# Altium schematic sheet PowerSupply.SchDoc
size B
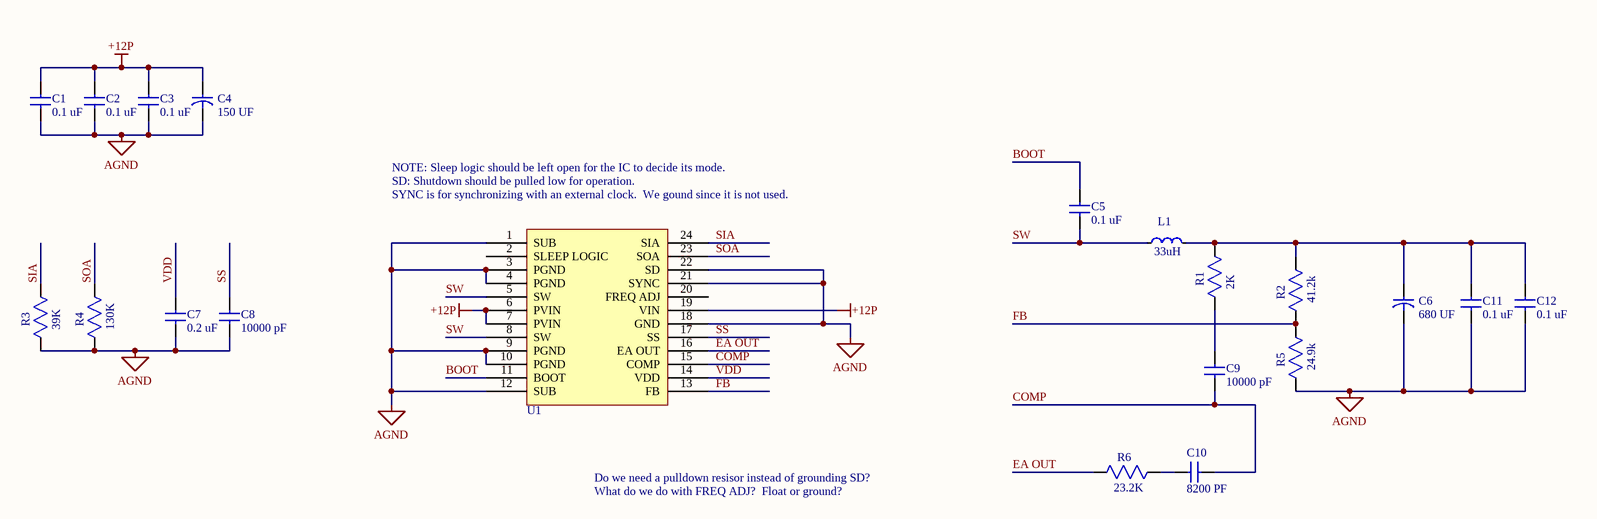
[diagram p0: PowerSupply.SchDoc]

## Parts
C1  value 0.1 uF  [0805]  (hidden comment: CAP 0.1uF)
C2  value 0.1 uF  [0805]  (hidden comment: CAP 0.1uF)
C3  value 0.1 uF  [0805]  (hidden comment: CAP 0.1uF)
C4  value 150 UF  [CAP_NICHICON_R7]  (hidden comment: CAP POLY 150UF)
C5  value 0.1 uF  [0805]  (hidden comment: CAP 0.1uF)
C6  value 680 UF  [CAP_NICHICON_R7]  (hidden comment: CAP POLY 680UF)
C7  value 0.2 uF  [0805]  (hidden comment: CAP 0.2uF)
C8  value 10000 pF  [0805]  (hidden comment: CAP 10000pF)
C9  value 10000 pF  [0805]  (hidden comment: CAP 10000pF)
C10  value 8200 PF  [0805]  (hidden comment: CAP 8200 PF)
C11  value 0.1 uF  [0805]  (hidden comment: CAP 0.1uF)
C12  value 0.1 uF  [0805]  (hidden comment: CAP 0.1uF)
L1  value 33uH  [L_SRR1210]  (hidden comment: L_33uH_20%)
R1  value 2K  [0805]  (hidden comment: R_0805_2K_1%)
R2  value 41.2k  [0805]  (hidden comment: R_0805_41.2K_1%)
R3  value 39K  [0805]  (hidden comment: R_0805_39K_1%)
R4  value 130K  [0805]  (hidden comment: R_0805_130K_1%)
R5  value 24.9k  [0805]  (hidden comment: R_0805_24.9k_1%)
R6  value 23.2K  [0805]  (hidden comment: R_0805_23.2K_1%)
U1  LM2650 DC/DC Converter  [SOIC127P1030X265-24N]  (value not drawn)

## Nets
+12P: C1.1 C2.1 C3.1 C4.1 U1.6(PVIN) U1.7(PVIN) U1.19(VIN)
AGND: C1.2 C2.2 C3.2 C4.2 C6.2 C7.2 C8.2 C11.2 C12.2 R3.2 R4.2 R5.2 U1.1(SUB) U1.3(PGND) U1.4(PGND) U1.9(PGND) U1.10(PGND) U1.12(SUB) U1.18(GND) U1.21(SYNC) U1.22(SD)
BOOT: C5.1 U1.11(BOOT)
COMP: C9.2 C10.1 U1.15(COMP)
EA OUT: R6.2 U1.16(EA_OUT)
FB: R2.2 R5.1 U1.13(FB)
SIA: R3.1 U1.24(SIA)
SOA: R4.1 U1.23(SOA)
SS: C8.1 U1.17(SS)
SW: C5.2 L1.1 U1.5(SW) U1.8(SW)
VDD: C7.1 U1.14(VDD)
NetC6_1: C6.1 C11.1 C12.1 L1.2 R1.1 R2.1
NetC9_1: C9.1 R1.2
NetC10_2: C10.2 R6.1

Not connected (* = marked no-connect by the designer): U1 2(SLEEP_LOGIC) 20(FREQ_ADJ)

## Notes on the sheet
- NOTE: Sleep logic should be left open for the IC to decide its mode.
- SD: Shutdown should be pulled low for operation.
- (near U1) SYNC is for synchronizing with an external clock.  We gound since it is not used.
- Do we need a pulldown resisor instead of grounding SD?
- What do we do with FREQ ADJ?  Float or ground?

## Library data of the parts
C1-C3 C5 = C_0805_0.1uF_1: CAP CERM 0.1uF; Manufacturer: Yageo; Manufacturer PN: CC0805ZRY5V9BB104; SVP Creator: Brett Paulsen; Package: 0805; Known Distributors: Digikey; ComponentLink1Description: Datasheet; ComponentLink1URL: SVN Datasheet URL; Price: .028
C4 = C_POLY_150UF: CAP POLY 150UF 20V HT 125C RAD; Manufacturer: Nichicon; Manufacturer PN: RHT1D151MDN1; SVP Creator: Jonathan Nutzmann; Tolerance: 20%; ESR: 20.0 mOhm; Package: Radial, Can; Known Distributors: Digikey; ComponentLink1Description: Datasheet; ComponentLink1URL: SVN Datasheet URL; Price: 0.99
C6 = C_POLY_680UF_10V: CAP POLY 680UF 10V LOW ESR RAD; Manufacturer: Nichicon; Manufacturer PN: RR71A681MDN1; SVP Creator: Jonathan Nutzmann; ESR: 7.0 mOhm; Package: Radial, Can; Known Distributors: Digikey; ComponentLink1Description: Datasheet; ComponentLink1URL: SVN Datasheet URL; Price: 0.73
C7 = C_0805_0.2uF: CAP CERM 0.2uF; SVP Creator: Brett Paulsen; Package: 0805; Known Distributors: Digikey; ComponentLink1Description: Datasheet; ComponentLink1URL: SVN Datasheet URL
C8 C9 = C_0805_10000pF: CAP CERM 10000PF; Manufacturer: AVX; Manufacturer PN: 08051A200JAT2A; SVP Creator: Jonathan Nutzmann; Package: 0805; Known Distributors: Digikey; ComponentLink1Description: Datasheet; ComponentLink1URL: SVN Datasheet URL; Price: 0.231
C10 = C_0805_8200PF_100V: CAP CERM 8200 PF; SVP Creator: Jonathan Nutzmann; Package: 0805; Known Distributors: Digikey; ComponentLink1Description: Datasheet; ComponentLink1URL: SVN Datasheet URL
C11 C12 = C_0805_0.1uF: CAP CERM 0.1uF; Manufacturer: Yageo; Manufacturer PN: CC0805ZRY5V9BB104; SVP Creator: Brett Paulsen; Package: 0805; Known Distributors: Digikey; ComponentLink1Description: Datasheet; ComponentLink1URL: SVN Datasheet URL; Price: .028
L1 = L_33uH_20%: INDUCTOR PWR 33UH 20% SHIELD SMD; Manufacturer: Bourns Inc; Manufacturer PN: SRR1210-330M; Current Rating: 3.7A; SVP Creator: Jonathan Nutzmann; Package: 0.472" L x 0.472" W x 0.394" H (12.00mm x 12.00mm x 10.00mm); Known Distributor: Digikey; ComponentLink1Description: Datasheet
R1 = R_0805_2K_1%_2K: RES 2K OHM 1/8W 1% 0805 SMD; Power Rating: .125W; SVP Creator: Jonathan Nutzmann; Package: 0805; Known Distributor: Digikey; ComponentLink1Description: Datasheet
R2 = R_0805_41.2K_1%: RES 41.2K OHM 1/8W 1% 0805 SMD; Power Rating: .125W; SVP Creator: Jonathan Nutzmann; Package: 0805; Known Distributor: Digikey; ComponentLink1Description: Datasheet
R3 = R_0805_39K_1%_5: RES 39K OHM 1/8W 1% 0805 SMD; Power Rating: .125W; SVP Creator: Jonathan Nutzmann; Package: 0805; Known Distributor: Digikey; ComponentLink1Description: Datasheet
R4 = R_0805_130K_1%: RES 130K OHM 1/8W 1% 0805 SMD; Power Rating: .125W; SVP Creator: Jonathan Nutzmann; Package: 0805; Known Distributor: Digikey; ComponentLink1Description: Datasheet
R5 = R_0805_24.9k_1%: RES 24.9K OHM 1/8W 1% 0805 SMD; Power Rating: .125W; SVP Creator: Jonathan Nutzmann; Package: 0805; Known Distributor: Digikey; ComponentLink1Description: Datasheet
R6 = R_0805_23.2K_1%: RES 23.2K OHM 1/8W 1% 0805 SMD; Power Rating: .125W; SVP Creator: Jonathan Nutzmann; Package: 0805; Known Distributor: Digikey; ComponentLink1Description: Datasheet
U1 = U_LM2650: IC CONVERTER SYNCH DC/DC 24-SOIC; Manufacturer: National Semiconductor; SVP Creator: Jonathan Nutzmann; Package: SOIC-24; Manufacturer PN: LM2650; ComponentLink1Description: Datasheet; ComponentLink1URL: SVN Datasheet URL; Price: 0